# EAGLE schematic deploy_sch (EAGLE 9.6.0)

## Sheet 1 of 2
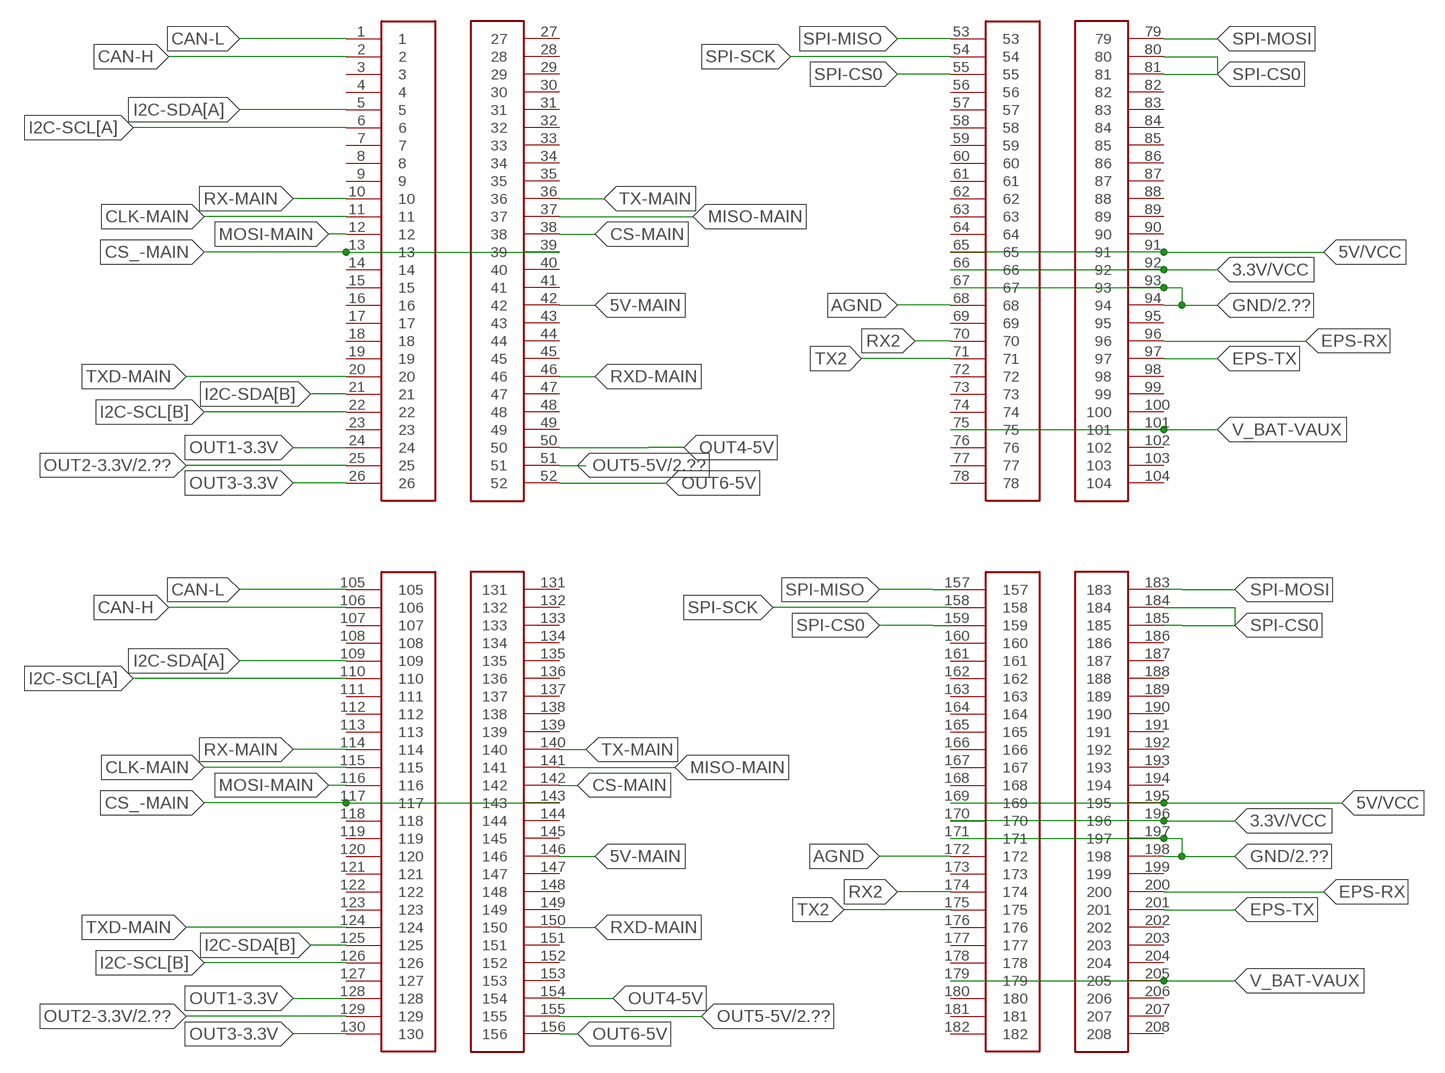
[diagram p0: schematic, sheet 1]

### Parts
U$1  SUCHAI_STACKBREAKOUT  [SUCHAI_STACKBREAKOUT]

### Nets
3.3V/VCC: U$1.66 U$1.92 U$1.170 U$1.196
5V-MAIN: U$1.42 U$1.146
5V/VCC: U$1.65 U$1.91 U$1.169 U$1.195
AGND: U$1.68 U$1.172
CAN-H: U$1.2 U$1.106
CAN-L: U$1.1 U$1.105
CLK-MAIN: U$1.11 U$1.115
CS-MAIN: U$1.38 U$1.142
CS_-MAIN: U$1.13 U$1.39 U$1.117 U$1.143
EPS-RX: U$1.96 U$1.200
EPS-TX: U$1.97 U$1.201
GND: U$1.67 U$1.93 U$1.94 U$1.171 U$1.197 U$1.198 ; also sheet 2
I2C-SCL[A]: U$1.6 U$1.110
I2C-SCL[B]: U$1.22 U$1.126
I2C-SDA[A]: U$1.5 U$1.109
I2C-SDA[B]: U$1.21 U$1.125
MISO-MAIN: U$1.37 U$1.141
MOSI-MAIN: U$1.12 U$1.116
OUT1-3.3V: U$1.24 U$1.128
OUT2-3.3V: U$1.25 U$1.129 ; also sheet 2
OUT3-3.3V: U$1.26 U$1.130
OUT4-5V: U$1.50 U$1.154
OUT5-5V: U$1.51 U$1.155 ; also sheet 2
OUT6-5V: U$1.52 U$1.156
RX2: U$1.70 U$1.174
RX-MAIN: U$1.10 U$1.114
RXD-MAIN: U$1.46 U$1.150
SPI-CS0: U$1.55 U$1.80 U$1.81 U$1.159 U$1.184 U$1.185
SPI-MISO: U$1.53 U$1.157
SPI-MOSI: U$1.79 U$1.183
SPI-SCK: U$1.54 U$1.158
TX2: U$1.71 U$1.175
TX-MAIN: U$1.36 U$1.140
TXD-MAIN: U$1.20 U$1.124
V_BAT-VAUX: U$1.75 U$1.101 U$1.179 U$1.205
Unconnected: U$1.3 U$1.4 U$1.7 U$1.8 U$1.9 U$1.14 U$1.15 U$1.16 U$1.17 U$1.18 U$1.19 U$1.23 U$1.27 U$1.28 U$1.29 U$1.30 U$1.31 U$1.32 U$1.33 U$1.34 U$1.35 U$1.40 U$1.41 U$1.43 U$1.44 U$1.45 U$1.47 U$1.48 U$1.49 U$1.56 U$1.57 U$1.58 U$1.59 U$1.60 U$1.61 U$1.62 U$1.63 U$1.64 U$1.69 U$1.72 U$1.73 U$1.74 U$1.76 U$1.77 U$1.78 U$1.82 U$1.83 U$1.84 U$1.85 U$1.86 U$1.87 U$1.88 U$1.89 U$1.90 U$1.95 U$1.98 U$1.99 U$1.100 U$1.102 U$1.103 U$1.104 U$1.107 U$1.108 U$1.111 U$1.112 U$1.113 U$1.118 U$1.119 U$1.120 U$1.121 U$1.122 U$1.123 U$1.127 U$1.131 U$1.132 U$1.133 U$1.134 U$1.135 U$1.136 U$1.137 U$1.138 U$1.139 U$1.144 U$1.145 U$1.147 U$1.148 U$1.149 U$1.151 U$1.152 U$1.153 U$1.160 U$1.161 U$1.162 U$1.163 U$1.164 U$1.165 U$1.166 U$1.167 U$1.168 U$1.173 U$1.176 U$1.177 U$1.178 U$1.180 U$1.181 U$1.182 U$1.186 U$1.187 U$1.188 U$1.189 U$1.190 U$1.191 U$1.192 U$1.193 U$1.194 U$1.199 U$1.202 U$1.203 U$1.204 U$1.206 U$1.207 U$1.208

## Sheet 2 of 2
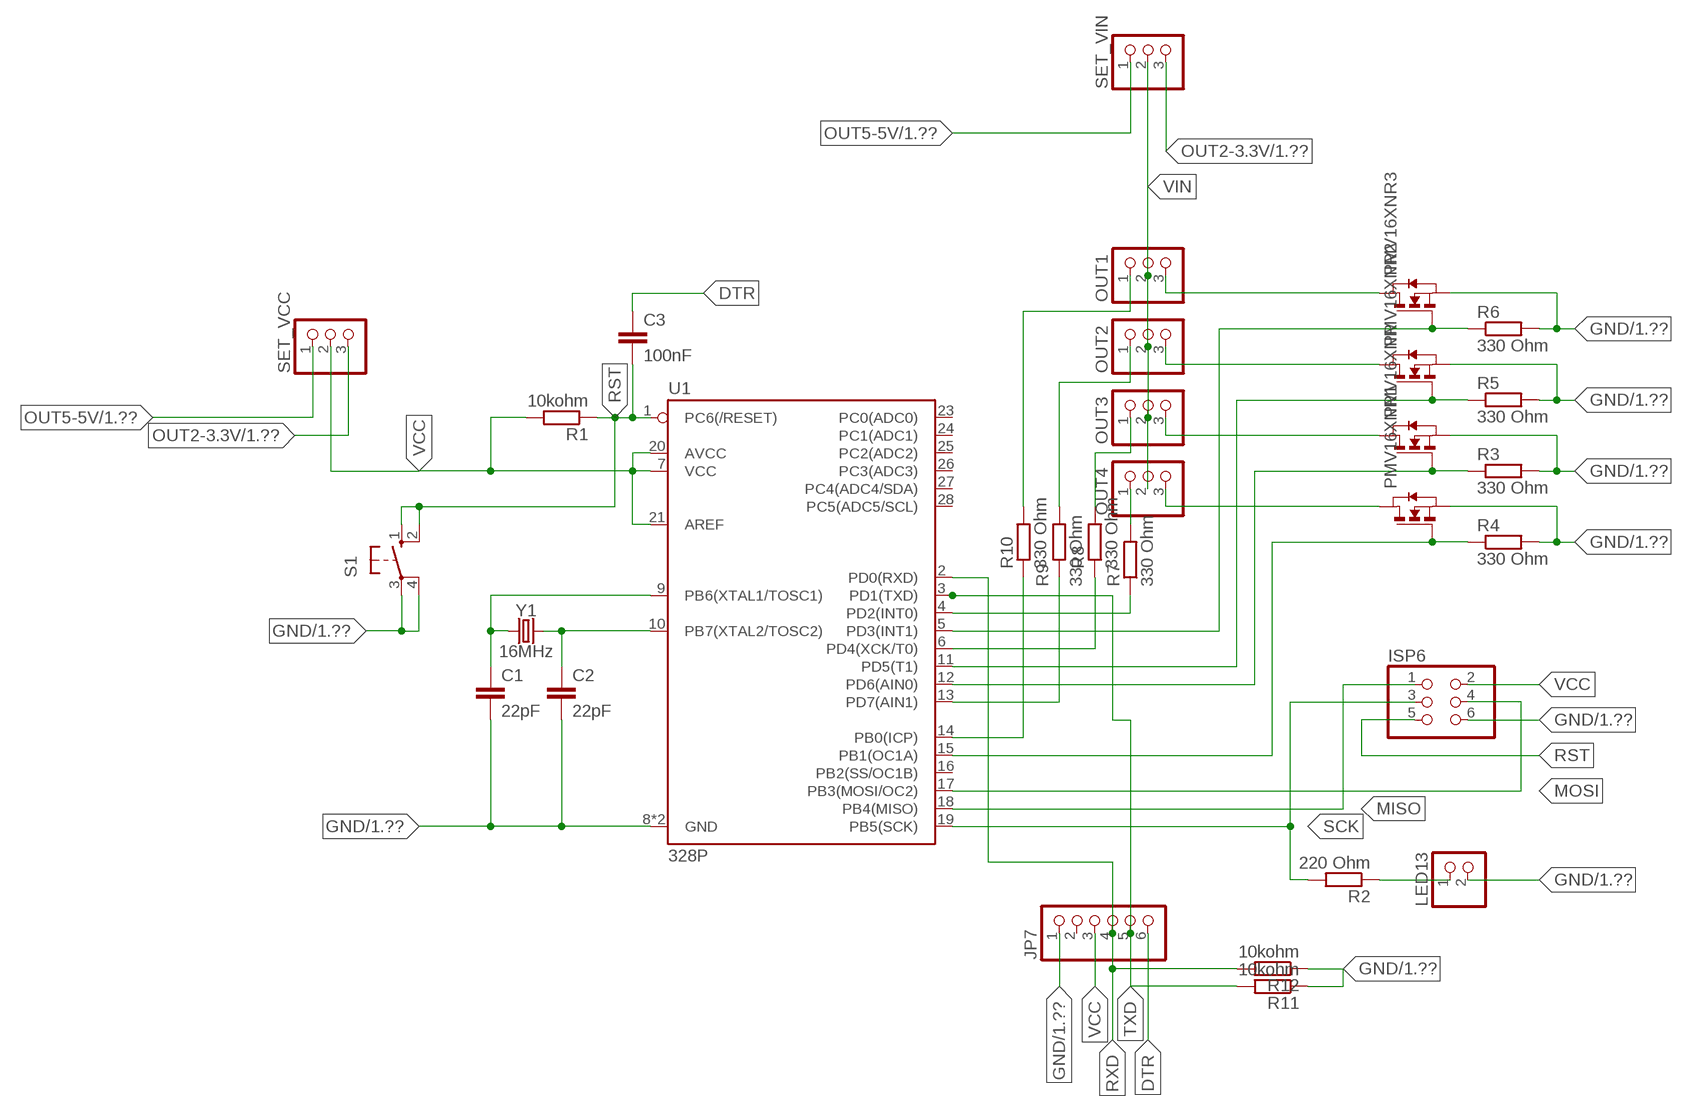
[diagram p1: schematic, sheet 2]

### Parts
C1  22pF  C-EU025-025X050  [C025-025X050]
C2  22pF  C-EU025-025X050  [C025-025X050]
C3  100nF  C-EU025-025X050  [C025-025X050]
ISP6  PINHD-2X3  [2X03]
JP7  PINHD-1X6  [1X06]
LED13  PINHD-1X2  [1X02]
OUT1  PINHD-1X3  [1X03]
OUT2  PINHD-1X3  [1X03]
OUT3  PINHD-1X3  [1X03]
OUT4  PINHD-1X3  [1X03]
PMV16XNR  NMOSSOT23  [SOT-23]
PMV16XNR1  NMOSSOT23  [SOT-23]
PMV16XNR2  NMOSSOT23  [SOT-23]
PMV16XNR3  NMOSSOT23  [SOT-23]
R1  10kohm  R-EU_0204/7  [0204/7]
R2  220 Ohm  R-EU_0204/7  [0204/7]
R3  330 Ohm  R-EU_0204/7  [0204/7]
R4  330 Ohm  R-EU_0204/7  [0204/7]
R5  330 Ohm  R-EU_0204/7  [0204/7]
R6  330 Ohm  R-EU_0204/7  [0204/7]
R7  330 Ohm  R-EU_0204/7  [0204/7]
R8  330 Ohm  R-EU_0204/7  [0204/7]
R9  330 Ohm  R-EU_0204/7  [0204/7]
R10  330 Ohm  R-EU_0204/7  [0204/7]
R11  10kohm  R-EU_0204/7  [0204/7]
R12  10kohm  R-EU_0204/7  [0204/7]
S1  10-XX  [B3F-10XX]
SET_VCC  PINHD-1X3  [1X03]
SET_VIN  PINHD-1X3  [1X03]
U1  328P  ATMEGA328P_PDIP  [DIP28]
Y1  16MHz  CRYSTAL-16MHZPTH-HC49US  [HC49US]

### Nets
DTR: C3.1 JP7.6
GND: C1.2 C2.2 ISP6.6 JP7.1 LED13.2 PMV16XNR1.2(S) PMV16XNR2.2(S) PMV16XNR3.2(S) PMV16XNR.2(S) R3.2 R4.2 R5.2 R6.2 R11.1 R12.1 S1.3(P) S1.4(P1) U1.8(GND) U1.22(GND) ; also sheet 1
MISO: ISP6.1 U1.18(PB4(MISO))
MOSI: ISP6.4 U1.17(PB3(MOSI/OC2))
N$1: C1.1 U1.9(PB6(XTAL1/TOSC1)) Y1.1
N$2: C2.1 U1.10(PB7(XTAL2/TOSC2)) Y1.2
N$3: PMV16XNR.3(G) R3.1 U1.12(PD6(AIN0))
N$4: LED13.1 R2.1
N$5: PMV16XNR1.3(G) R4.1 U1.15(PB1(OC1A))
N$6: PMV16XNR2.3(G) R5.1 U1.11(PD5(T1))
N$7: PMV16XNR3.3(G) R6.1 U1.5(PD3(INT1))
N$8: OUT4.3 PMV16XNR1.1(D)
N$9: OUT3.3 PMV16XNR.1(D)
N$10: OUT2.3 PMV16XNR2.1(D)
N$11: OUT1.3 PMV16XNR3.1(D)
N$12: OUT4.1 R7.2
N$13: R7.1 U1.4(PD2(INT0))
N$14: OUT3.1 R8.2
N$15: R8.1 U1.6(PD4(XCK/T0))
N$16: R9.1 U1.13(PD7(AIN1))
N$17: OUT2.1 R9.2
N$18: OUT1.1 R10.2
N$19: R10.1 U1.14(PB0(ICP))
OUT2-3.3V: SET_VCC.3 SET_VIN.3 ; also sheet 1
OUT5-5V: SET_VCC.1 SET_VIN.1 ; also sheet 1
RST: C3.2 ISP6.5 R1.1 S1.1(S) S1.2(S1) U1.1(PC6(/RESET))
RXD: JP7.4 R12.2 U1.2(PD0(RXD))
SCK: ISP6.3 R2.2 U1.19(PB5(SCK))
TXD: JP7.5 R11.2 U1.3(PD1(TXD))
VCC: ISP6.2 JP7.3 R1.2 SET_VCC.2 U1.7(VCC) U1.20(AVCC) U1.21(AREF)
VIN: OUT1.2 OUT2.2 OUT3.2 OUT4.2 SET_VIN.2
Unconnected: JP7.2 U1.16(PB2(SS/OC1B)) U1.23(PC0(ADC0)) U1.24(PC1(ADC1)) U1.25(PC2(ADC2)) U1.26(PC3(ADC3)) U1.27(PC4(ADC4/SDA)) U1.28(PC5(ADC5/SCL))

## Library data of the parts
C1-C3 = resistor:C-EU: CAPACITOR, European symbol
ISP6 = pinhead:PINHD-2X3: PIN HEADER
JP7 = pinhead:PINHD-1X6: PIN HEADER
LED13 = pinhead:PINHD-1X2: PIN HEADER
OUT1-OUT4 SET_VCC SET_VIN = pinhead:PINHD-1X3: PIN HEADER
PMV16XNR PMV16XNR1-PMV16XNR3 = zetex:NMOSSOT23: MOS FET; OC_FARNELL: unknown; OC_NEWARK: unknown
R1-R12 = resistor:R-EU_: RESISTOR, European symbol
S1 = switch-omron:10-XX: OMRON SWITCH; MPN: B3F-1000; OC_FARNELL: 176432; OC_NEWARK: 36M3542
U1 = SparkFun-IC-Microcontroller:ATMEGA328P_PDIP: Atmel 328P Through hole ATMEGA328P uC used in the Arduino 32kb flash, 1k EEPROM, 2k SRAM Datasheet <http://www.sparkfun.com/datasheets/Components/SMD/ATMega328.pdf> SparkFun Products Storefront component: AVR 28 Pin 20MHz 32K 6A/D - ATMega328P <https://www.sparkfun.com/products/9061> (COM-09061) SparkFun Simon Says - Through-Hole Soldering Kit <https://www.sparkfun.com/products/10547> (KIT-10547) SparkFun Learn to Solder - Simon Says <https://www.sparkfun.com/products/13708> (KIT-13708) SparkFun BigTime Watch Kit <https://www.sparkfun.com/products/11734> (KIT-11734) SparkFun ClockIt <https://www.sparkfun.com/products/10930> (KIT-10930) SparkFun Serial Enabled LCD Kit <https://www.sparkfun.com/products/10097> (LCD-10097) SparkFun Simon Tilts - Through Hole Soldering Kit <https://www.sparkfun.com/products/12634> (KIT-12634) SparkFun Frequency Counter Kit <https://www.sparkfun.com/products/10140> (KIT-10140) FabFM Radio Kit <https://www.sparkfun.com/products/11043> (KIT-11043) SparkFun Binary Blaster Kit <https://www.sparkfun.com/products/12037> (KIT-12037) SparkFun Metro-Gnome <https://www.sparkfun.com/products/9236> (KIT-09236) ATmega328 with Arduino Optiboot (Uno) <https://www.sparkfun.com/products/10524> (DEV-10524); PROD_ID: IC-09136
U$1 = SUCHAI_PCB:SUCHAI_STACKBREAKOUT
Y1 = SparkFun-Clocks:CRYSTAL-16MHZ: 16MHz Crystal Digikey Example <http://www.digikey.com/product-search/en?keywords=535-9122-1-ND> Frequency: 16MHz Frequency Stability: ±50ppm Frequency Tolerance: ±20ppm Load Capacitance: 18pF SparkFun Products: Pro Micro -5V/16MHz <https://www.sparkfun.com/products/12640> SparkFun Serial Enabled LCD Kit <https://www.sparkfun.com/products/10097>; PROD_ID: XTAL-08181; SF_ID: COM-00536